# Altium schematic sheet alimentation.SchDoc: 2225B_VumetreFrequentiel
size 276 x 198 mm; Date: 24.09.2024; DrawnBy: LDA; DocumentNumber: 1.0; SheetNumber: 2; SheetTotal: 6
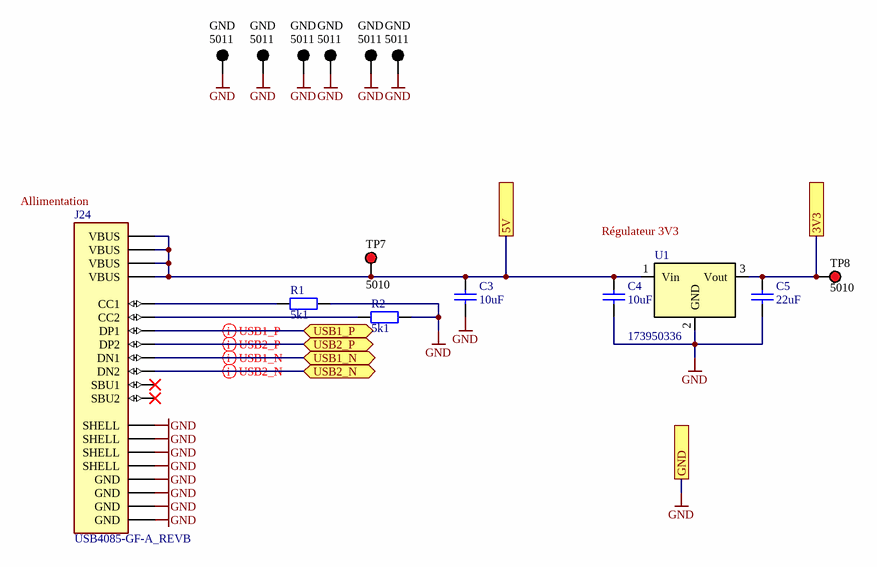
[diagram p0: alimentation.SchDoc]

## Parts
(Parts that share a designator on the sheet are numbered #1, #2 ... from top to bottom, then left to right.)
C3  10uF  [C0805]
C4  10uF  [C0805]
C5  22uF  [C0805]
GND#1  5011  [KSTN-5011_V]
GND#2  5011  [KSTN-5011_V]
GND#3  5011  [KSTN-5011_V]
GND#4  5011  [KSTN-5011_V]
GND#5  5011  [KSTN-5011_V]
GND#6  5011  [KSTN-5011_V]
J24  USB4085-GF-A_REVB  [GCT_USB4085-GF-A_REVB]
R1  5k1  [RESC2012X06M]
R2  5k1  [RESC2012X06M]
TP7  5010  [KSTN-5010_V]
TP8  5010  [KSTN-5010_V]
U1  173950336  [WPME-FDSM_SIP-3_L11.6W8H10.4]

## Ports
3V3, 5V, GND, USB1_N (bidir), USB1_P (bidir), USB2_N (bidir), USB2_P (bidir)

## Nets
GND: C3.1 C4.1 C5.1 GND#1.1 GND#2.1 GND#3.1 GND#4.1 GND#5.1 GND#6.1 J24.A1(GND) J24.A12(GND) J24.B1(GND) J24.B12(GND) J24.S1(SHELL) J24.S2(SHELL) J24.S3(SHELL) J24.S4(SHELL) R1.1 R2.1 U1.2(GND) ; port GND
3V3: C5.2 TP8.1 U1.3(Vout) ; port 3V3
5V: C3.2 C4.2 J24.A4(VBUS) J24.A9(VBUS) J24.B4(VBUS) J24.B9(VBUS) TP7.1 U1.1(Vin) ; port 5V
USB1_N: J24.A7(DN1) ; port USB1_N
USB1_P: J24.A6(DP1) ; port USB1_P
USB2_N: J24.B7(DN2) ; port USB2_N
USB2_P: J24.B6(DP2) ; port USB2_P
NetJ24_A5: J24.A5(CC1) R1.2
NetJ24_B5: J24.B5(CC2) R2.2

Not connected (* = marked no-connect by the designer): J24 A8(SBU1)* B8(SBU2)*

## Layout directives
differential pair: USB1_N, USB1_P, USB2_N, USB2_P

## Notes on the sheet
- (near J24) Allimentation
- Régulateur 3V3
- a
- Dessiné
- A4
- Echelle :
- Mod.
- b
- c
- d
- Contrôlé
- Remplace
- Nb. feuilles
- Feuille n°
- Nom du projet
- No

## Library data of the parts
C3-C5 = Cap: Capacitor; Published: 8-Jun-2000; LatestRevisionDate: 17-Jul-2002; LatestRevisionNote: Re-released for DXP Platform.; PackageReference: RAD-0.3; Publisher: Altium Limited; PackageDescription: Radial Cap, Thru-Hole; 2 Leads; 0.3 in Pin Spacing
  C3 C4: Value: 10uF
  C5: Value: 22uF
GND#1-GND#6 = CMP-1672-00003-4: Test Point, Black, Through Hole, RoHS, Bulk; Manufacturer: Keystone; ComponentLink2URL: http://www.keyelco.com/product-pdf.cfm?p=1320; Colour: Black; Pins: 1; REACH SVHC: No SVHC; ComponentLink1URL: http://www.keyelco.com/; PackageReference: 5011; Contact Plating: Silver; Package Quantity: 100; Packaging: Bulk; RoHSCompliant: true; Height: 8.12 mm; PackageDescription: 1-Pin Through Hole Device, Dia 3.17 mm; Mount: Through Hole; Mounting Technology: Through Hole; DatasheetVersion: Rev. F, 12/2013; ComponentLink1Description: Manufacturer URL; Contact Material: Bronze; ComponentLink2Description: Datasheet
J24 = USB4085-GF-A_REVB: USB-C (USB TYPE-C) USB 2.0 æ’åº§è¿žæŽ¥å™¨ 24 (16+8 Dummy) ä½é€šå­”ã€ç›´è§’ã€ä½Žæˆæœ¬ã€3.46mm å¤–å½¢ã€16 é’ˆã€æ°´å¹³ã€é¡¶éƒ¨å®‰è£…; MF: Global Connector Technology; SnapEDA_Link: https://www.snapeda.com/parts/USB4085-GF-A/Global+Connector+Technology/view-part/?ref=snap; Package: None; Value: *; MP: USB4085-GF-A; Check_prices: https://www.snapeda.com/parts/USB4085-GF-A/Global+Connector+Technology/view-part/?ref=eda
R1 R2 = Res2: Resistor; Published: 8-Jun-2000; LatestRevisionDate: 17-Jul-2002; LatestRevisionNote: Re-released for DXP Platform.; PackageReference: AXIAL-0.4; Publisher: Altium Limited; PackageDescription: Axial Device, Thru-Hole; 2 Leads; 0.4 in Pin Spacing; Value: 5k1
TP7 TP8 = CMP-1672-00002-4: Test Point, Red, Through Hole, RoHS, Bulk; Manufacturer: Keystone; Contact Material: Bronze; Mounting Technology: Through Hole; RoHSCompliant: true; Pins: 1; Package Quantity: 100; ComponentLink2Description: Datasheet; Height: 8.12 mm; ComponentLink1URL: http://www.keyelco.com/; DatasheetVersion: Rev. F, 12/2013; Mount: Through Hole; PackageReference: 5010; Contact Plating: Silver; Packaging: Bulk; Colour: Red; REACH SVHC: No SVHC; PackageDescription: 1-Pin Through Hole Device, Dia 3.17 mm; ComponentLink2URL: http://www.keyelco.com/product-pdf.cfm?p=1319; ComponentLink1Description: Manufacturer URL
U1 = 173950536